# EAGLE design PROK drum_B (EAGLE 7.4.0)
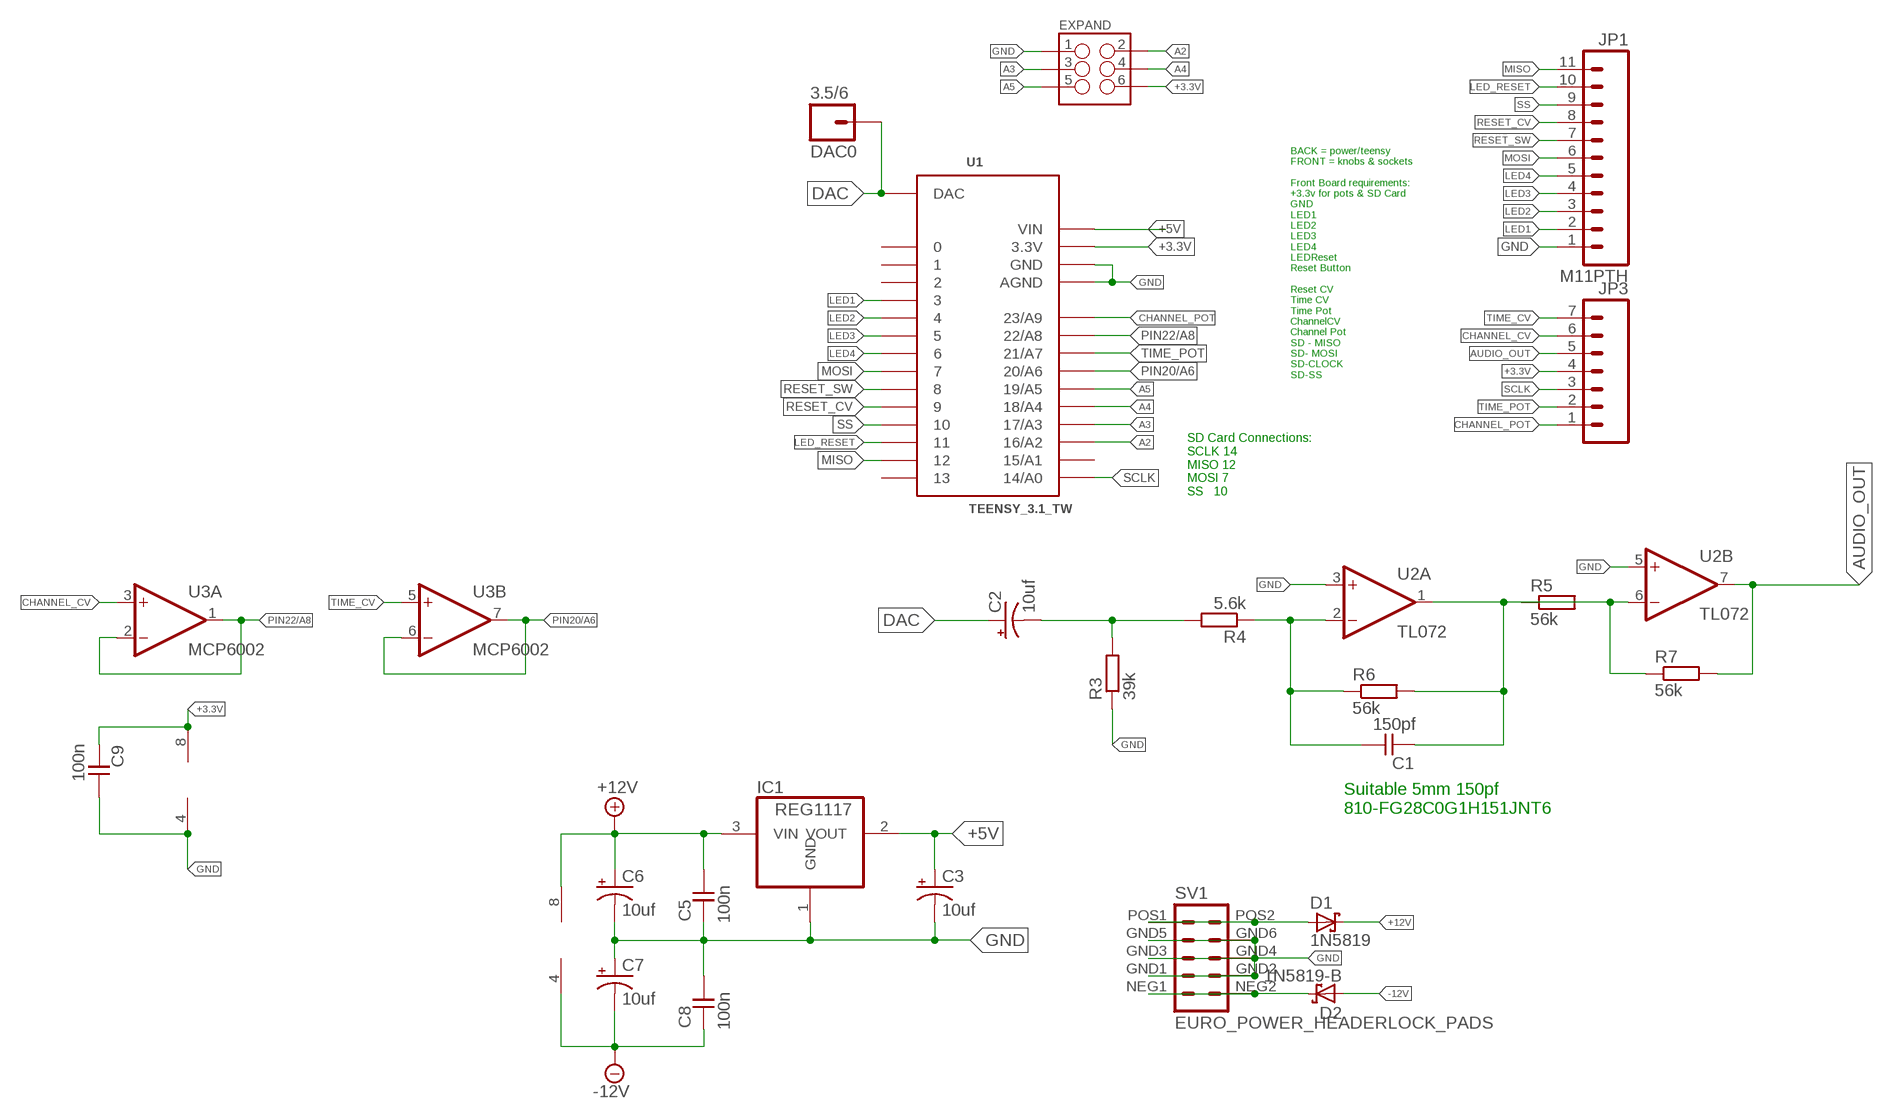
[diagram p0: schematic, sheet 1]

## Parts
3.5/6  DAC0  M01PTH  [1X01]
C1  150pf  C-EU050-024X044  [C050-024X044]
C2  10uf  CAP_POLPTH2  [CPOL-RADIAL-10UF-25V]
C3  10uf  CAP_POLPTH2  [CPOL-RADIAL-10UF-25V]
C5  100n  C-EU050-024X044  [C050-024X044]
C6  10uf  CAP_POLPTH2  [CPOL-RADIAL-10UF-25V]
C7  10uf  CAP_POLPTH2  [CPOL-RADIAL-10UF-25V]
C8  100n  C-EU050-024X044  [C050-024X044]
C9  100n  C-EU050-024X044  [C050-024X044]
D1  1N5819  1N5819-B  [DO41-7.6]
D2  1N5819-B  [DO41-7.6]
EXPAND  M03X22X3_SILK_SM  [2X3]
IC1  REG1117  [SOT223]
JP1  M11PTH  [1X11]
JP3  M07  [1X07]
R3  39k  RESISTOR7MM  [7MM_RESISTOR]
R4  5.6k  RESISTOR7MM  [7MM_RESISTOR]
R5  56k  RESISTOR7MM  [7MM_RESISTOR]
R6  56k  RESISTOR7MM  [7MM_RESISTOR]
R7  56k  RESISTOR7MM  [7MM_RESISTOR]
SV1  EURO_POWER_HEADERLOCK_PADS  [EURO_PWR_HEADER_LOCK]
U1  TEENSY_3.1_TW  [TEENSY_3.1_TW]
U2  TL072  [DIL08-SML]
U3  MCP6002  MCP6002DIL_SMALL  [DIL08-SML]

## Nets
+3.3V: C9.2 EXPAND.6 JP3.4 U1.3.3V U3.8(P:V+)
+5V: C3.1(+) IC1.2(VOUT) U1.VIN
+12V [power]: C5.1 C6.1(+) D1.C IC1.3(VIN) U2.8(P:V+)
-12V [power]: C7.2(-) C8.2 D2.A U2.4(P:V-)
A2: EXPAND.2 U1.16/A2
A3: EXPAND.3 U1.17/A3
A4: EXPAND.4 U1.18/A4
A5: EXPAND.5 U1.19/A5
AUDIO_OUT: JP3.5 R7.2 U2.7(B:OUT)
CHANNEL_CV: JP3.6 U3.3(A:+IN)
CHANNEL_POT: JP3.1 U1.23/A9
DAC: 3.5/6.1 C2.1(+) U1.DAC
GND [ground]: C3.2(-) C5.2 C6.2(-) C7.1(+) C8.1 C9.1 EXPAND.1 IC1.1(GND) JP1.1 R3.1 SV1.GND1 SV1.GND2 SV1.GND3 SV1.GND4 SV1.GND5 SV1.GND6 U1.AGND U1.GND U2.3(A:+IN) U2.5(B:+IN) U3.4(P:V-)
LED1: JP1.2 U1.3
LED2: JP1.3 U1.4
LED3: JP1.4 U1.5
LED4: JP1.5 U1.6
LED_RESET: JP1.10 U1.11
MISO: JP1.11 U1.12
MOSI: JP1.6 U1.7
N$1: C2.2(-) R3.2 R4.2
N$2: C1.1 R4.1 R6.1 U2.2(A:-IN)
N$3: R5.1 R7.1 U2.6(B:-IN)
N$4: C1.2 R5.2 R6.2 U2.1(A:OUT)
N$5: D1.A SV1.POS1 SV1.POS2
N$9: D2.C SV1.NEG1 SV1.NEG2
PIN20/A6: U1.20/A6 U3.6(B:-IN) U3.7(B:OUT)
PIN22/A8: U1.22/A8 U3.1(A:OUT) U3.2(A:-IN)
RESET_CV: JP1.8 U1.9
RESET_SW: JP1.7 U1.8
SCLK: JP3.3 U1.14/A0
SS: JP1.9 U1.10
TIME_CV: JP3.7 U3.5(B:+IN)
TIME_POT: JP3.2 U1.21/A7
Unconnected: U1.0 U1.1 U1.2 U1.13 U1.15/A1

## Notes on the sheet
- BACK = power/teensy
  FRONT = knobs & sockets
  
  Front Board requirements:
  +3.3v for pots & SD Card 
  GND 
  LED1
  LED2
  LED3
  LED4
  LEDReset
  Reset Button
  
  Reset CV 
  Time CV
  Time Pot
  ChannelCV
  Channel Pot
  SD - MISO
  SD- MOSI
  SD-CLOCK
  SD-SS
- SD Card Connections: 
   SCLK 14
   MISO 12
   MOSI 7 
   SS   10
- Suitable 5mm 150pf 
  810-FG28C0G1H151JNT6

## Library data of the parts
3.5/6 = SparkFun-Connectors:M01: Header 1 Standard 1-pin 0.1" header. Use with straight break away headers (SKU : PRT-00116), right angle break away headers (PRT-00553), swiss pins (PRT-00743), machine pins (PRT-00117), and female headers (PRT-00115).
C1 C5 C8 C9 = TomW:C-EU: CAPACITOR, European symbol
C2 C3 C6 C7 = SparkFun-Passives:CAP_POL: Capacitor Polarized These are standard SMD and PTH capacitors. Normally 10uF, 47uF, and 100uF in electrolytic and tantalum varieties. Always verify the external diameter of the through hole cap, it varies with capacity, voltage, and manufacturer. The EIA devices should be standard.
D1 D2 = diode:1N581*: 1.0A SCHOTTKY BARRIER RECTIFIER Source: http://www.diodes.com/datasheets/ds23001.pdf
EXPAND = SparkFun-Connectors:M03X2: 2x3 .1" header. Shrouded, with keying- CONN-10681 SMT- CONN-11415 Pogo pins- HW-11044
IC1 = burr-brown:REG1117: 800mA and 1A Low Dropout (LDO) Positive Regulator 1.8V, 2.5V, 2.85V, 3.3V, 5V, and Adj; MPN: REG1117; OC_FARNELL: 1097566; OC_NEWARK: 14P6981
JP1 = SparkFun-Connectors:M11: Header 11 Standard 11-pin 0.1" header. Use with straight break away headers (SKU : PRT-00116), right angle break away headers (PRT-00553), swiss pins (PRT-00743), machine pins (PRT-00117), and female headers (PRT-00115).
JP3 = SparkFun-Connectors:M07: Header 7 Standard 7-pin 0.1" header. Use with straight break away headers (SKU : PRT-00116), right angle break away headers (PRT-00553), swiss pins (PRT-00743), machine pins (PRT-00117), and female headers (PRT-00115). NOTES ON THE VARIANTS LOCK and LOCK_LONGPADS... This footprint was designed to help hold the alignment of a through-hole component (i.e. 7-pin header) while soldering it into place. You may notice that each hole has been shifted either up or down by 0.005 of an inch from it's more standard position (which is usually a perfectly straight line). This slight alteration caused the pins (the squares in the middle) to touch the edges of the holes. Because they are alternating, it causes a "brace" to hold the header in place. 0.005 has proven to be the perfect amount of "off-center" position when using our standard breakaway headers. Although looks a little odd when you look at the bare footprint, once you have a header in there, the alteration is very hard to notice. Also, if you push a header all the way into place, it is covered up entirely on the bottom side. This idea of altering the position of holes to aid alignment will be further integrated into the Sparkfun Library for other footprints. It can help hold any component with 3 or more connection pins.
R3-R7 = MusicThingModular:RESISTOR: Standard resistor, various versions
SV1 = MusicThingModular:EURO_POWER_HEADER: Power Header 10 pin power header for Eurorack Power Supplies Variants with fatter pads for easier soldering, and the LOCK variant which has 5mil offset pins to hold the component in place before soldering
U1 = TomW:TEENSY_3.1_TW: Basic Teensy 3.0 with none of the 'inner' pins enabled. See '+4', 'AllAnalogPins", and 'AllPins' packages for additional pin holes, as needed.
U2 = MusicThingModular:TL072: Generic Dual Op Amp
U3 = MusicThingModular:MCP6002: Generic Dual Op Amp

## Net classes
0 default: width 0.203 mm
1 power: width 0.406 mm
2 ground: width 0.305 mm

## Board
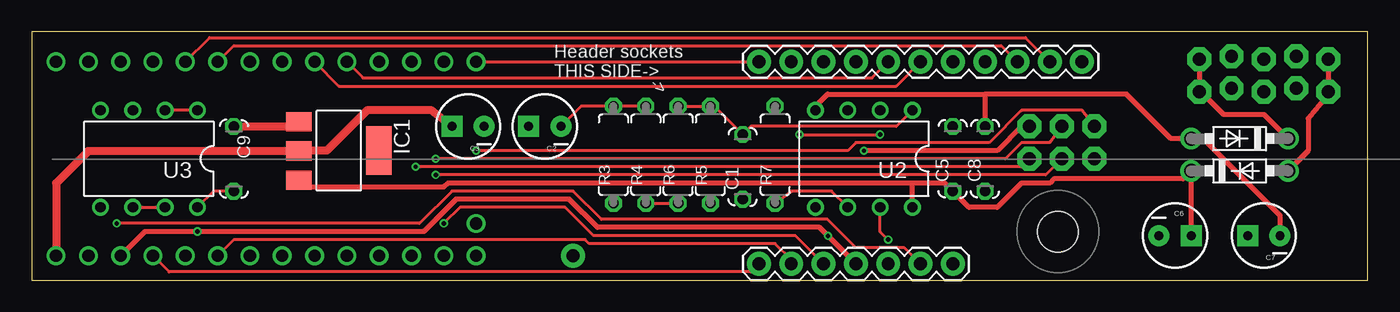
[diagram p1: board, top side]
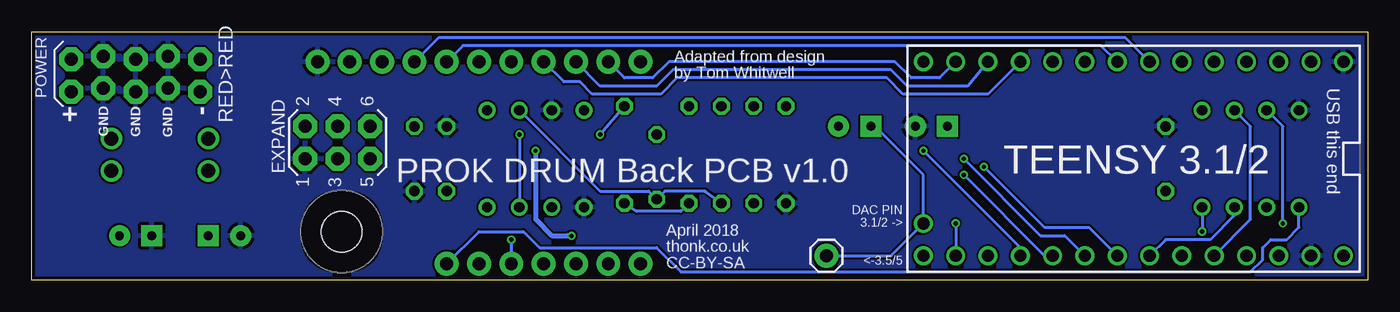
[diagram p2: board, bottom side, seen from below]

Size 105 x 19.5 mm. Coordinates in mm from the lower left corner, seen from the top.
Outline: 0,19.5 0,0 105,0 105,19.5 0,19.5
Copper layers (1*2*15*16): Top 0.035mm / dielectric 0.2mm / Route2 0.0175mm / dielectric 1.1mm / Route15 0.0175mm / dielectric 0.2mm / Bottom 0.035mm
Design rules "SeeedStudio_DRU_no_angle_20130527 *": minimum track width 6mil, minimum drill 12mil, track to track 6mil, track to pad 6mil, pad to pad 6mil, via to via 6mil, smd to smd 0mil, copper to edge 10mil, drill to drill 10mil, minimum pad ring 10mil, minimum via ring 6mil, stop-mask expansion 2mil, vias tented up to drill 25mil, thermal gap 10mil

### Footprints (pad centres in the part's own frame; a part is rotated, then mirrored left to right if it is on the bottom)
1X01 = drill 1.016 pad 1.88: 1 0,0
C050-024X044 = drill 0.813 octagon: 1 -2.54,0; 2 2.54,0
CPOL-RADIAL-10UF-25V = drill 0.7 pad 1.651 square: 1 1.27,0 | drill 0.7 pad 1.651: 2 -1.27,0
DO41-7.6 = drill 1.1 pad 1.7: A 3.81,0; C -3.81,0
2X3 = drill 1.016 pad 1.88 octagon: 1 0,0; 2 0,2.54; 3 2.54,0; 4 2.54,2.54; 5 5.08,0; 6 5.08,2.54
SOT223 = smd 1.499 x 2.007: 1 -2.261,-3.15; 2 0.025,-3.15; 3 2.311,-3.15 | smd 3.81 x 2.007: 4 0,3.15
1X11 = drill 1.016 pad 1.88: 1 0,0; 2 2.54,0; 3 5.08,0; 4 7.62,0; 5 10.16,0; 6 12.7,0; 7 15.24,0; 8 17.78,0; 9 20.32,0; 10 22.86,0; 11 25.4,0
1X07 = drill 1.016 pad 1.88: 1 0,0; 2 2.54,0; 3 5.08,0; 4 7.62,0; 5 10.16,0; 6 12.7,0; 7 15.24,0
7MM_RESISTOR = drill 0.813 octagon: 1 -3.81,0; 2 3.81,0
EURO_PWR_HEADER_LOCK = drill 1.016 pad 1.88 octagon: GND1 -2.54,1.143; GND2 -2.54,-1.397; GND3 0,1.397; GND4 0,-1.143; GND5 2.54,1.143; GND6 2.54,-1.397; NEG1 -5.08,1.397; NEG2 -5.08,-1.143; POS1 5.08,1.397; POS2 5.08,-1.143
TEENSY_3.1_TW = drill 0.965: 0 -7.62,13.97; 1 -7.62,11.43; 2 -7.62,8.89; 3 -7.62,6.35; 3.3V 7.62,11.43; 4 -7.62,3.81; 5 -7.62,1.27; 6 -7.62,-1.27; 7 -7.62,-3.81; 8 -7.62,-6.35; 9 -7.62,-8.89; 10 -7.62,-11.43; 11 -7.62,-13.97; 12 -7.62,-16.51; 13 7.62,-16.51; 14/A0 7.62,-13.97; 15/A1 7.62,-11.43; 16/A2 7.62,-8.89; 17/A3 7.62,-6.35; 18/A4 7.62,-3.81; 19/A5 7.62,-1.27; 20/A6 7.62,1.27; 21/A7 7.62,3.81; 22/A8 7.62,6.35; 23/A9 7.62,8.89; AGND 7.62,13.97; DAC 5.08,-16.51; GND -7.62,16.51; VIN 7.62,16.51
DIL08-SML = drill 0.813 pad 1.27: 1 -3.81,-3.81; 2 -1.27,-3.81; 3 1.27,-3.81; 4 3.81,-3.81; 5 3.81,3.81; 6 1.27,3.81; 7 -1.27,3.81; 8 -3.81,3.81
MOUNTING_HOLE = hole 3.2: 0,0

### Placement (x,y rotation side)
3.5/6  42.55,1.91 0 bottom
C1  55.88,8.89 90 top
C2  40.32,12.06 180 top
C3  34.29,12.06 180 top
C5  72.39,9.53 90 top
C6  89.85,3.49 0 top
C7  96.84,3.49 180 top
C8  74.93,9.53 90 top
C9  15.88,9.53 270 top
D1  94.93,8.57 0 top
D2  94.93,11.11 180 top
EXPAND  83.5,9.53 0 bottom
IC1  24.13,10.16 270 top
JP1  82.55,17.14 180 top
JP3  57.15,1.27 0 top
R3  45.72,9.84 90 top
R4  48.26,9.84 90 top
R5  53.34,9.84 90 top
R6  50.8,9.84 90 top
R7  58.42,9.84 90 top
SV1  96.84,16.19 180 bottom
U1  18.41,9.53 270 bottom
U2  65.41,9.53 180 top
U3  9.21,9.53 180 top
U$1  [MOUNTING_HOLE]  80.64,3.81 0 top

### Tracks (layer width: path | path; a pad name or v marks a point on that pad's centre or on a via)
+3.3V  (via drill 0.33)
  Top 0.254: C9.2 14.29,6.99 U3.8
  Top 0.406: JP3.4 v62.58,3.46 61.91,4.13 44.45,4.13 42.23,6.35 33.34,6.35 30.8,3.81 v13.02,3.81 8.89,3.81 U1.3.3V | EXPAND.6 77.79,12.06 75.88,10.16 v65.41,10.16
  Bottom 0.254: U3.8 v13.02,3.81
  Bottom 0.406: v65.41,10.16 65.41,4.76 64.14,3.49 62.87,3.49 v62.58,3.46
+5V
  Top 0.254: 21.01,10.16 IC1.2
  Top 0.61: C3.1 31.43,13.34 26.35,13.34 23.18,10.16 21.01,10.16 | IC1.2 4.42,10.13 1.91,7.62 U1.VIN
+12V
  Top 0.406: C6.1 D1.C 90.49,7.94 80.33,7.94 80.01,7.62 77.79,7.62 75.88,5.71 73.66,5.71 C5.1 71.75,7.62 69.22,7.62 | 69.22,7.62 32.7,7.62 32.38,7.3 21.59,7.3 21.21,7.62 IC1.3 | U2.8 69.22,7.62
-12V
  Top 0.406: C7.2 98.11,5.08 92.08,11.11 D2.A 89.53,11.11 86.04,14.61 74.93,14.61 | 74.93,14.61 C8.2 | U2.4 61.59,13.65 62.55,14.61 74.93,14.61
A2  (via drill 0.33)
  Top 0.254: EXPAND.2 82.55,13.34 77.79,13.34 75.25,10.79 64.77,10.79 64.14,10.16 v34.92,10.16
  Bottom 0.254: v34.92,10.16 27.3,2.54 U1.16/A2
A3  (via drill 0.33)
  Top 0.254: EXPAND.3 79.69,8.26 v31.75,8.26
  Bottom 0.254: v31.75,8.26 25.4,1.91 U1.17/A3
A4  (via drill 0.33)
  Top 0.254: EXPAND.4 80.01,10.79 77.79,10.79 76.52,9.53 v31.75,9.53
  Bottom 0.254: v31.75,9.53 25.72,3.49 23.81,3.49 U1.18/A4
A5  (via drill 0.33)
  Top 0.254: EXPAND.5 77.79,8.89 v30.16,8.89
  Bottom 0.254: v30.16,8.89 25.4,4.13 21.91,4.13 U1.19/A5
AUDIO_OUT  (via drill 0.33)
  Top 0.254: v67.31,3.17 66.67,3.81 U2.7 | v60.33,11.43 v66.67,11.43
  Bottom 0.254: JP3.5 v67.31,3.17 | R7.2 v60.33,11.43 | v66.67,11.43 U2.7
CHANNEL_CV  (via drill 0.33)
  Top 0.254: JP3.6 68.58,2.54 64.77,2.54 62.55,4.76 44.77,4.76 42.55,6.99 33.02,6.99 30.48,4.45 v6.67,4.45
  Bottom 0.254: v6.67,4.45 6.67,12.06 U3.3
CHANNEL_POT
  Top 0.254: JP3.1 56.52,0.64 10.79,0.64 U1.23/A9
DAC
  Bottom 0.254: 3.5/6.1 37.47,1.91 U1.DAC 34.92,8.26 38.73,12.06 C2.1
GND
  Top 0.61: C9.1 20.62,12.06 IC1.1
  pour Bottom: -1.27,-1.27 109.22,-1.27 109.22,20.95 -1.27,20.95
LED1
  Top 0.254: U1.3 13.97,19.05 78.11,19.05 JP1.2
LED2
  Top 0.254: U1.4 15.88,18.41 76.2,18.41 JP1.3
LED3
  Bottom 0.254: U1.5 19.05,19.05 73.03,19.05 JP1.4
LED4
  Bottom 0.254: U1.6 20.95,18.41 71.12,18.41 JP1.5
LED_RESET
  Bottom 0.254: U1.11 33.66,15.88 35.88,15.88 37.15,17.14 54.93,17.14 56.2,15.88 58.42,15.88 JP1.10
MISO
  Top 0.254: U1.12 JP1.11
MOSI
  Top 0.254: U1.7 24.13,15.24 67.94,15.24 JP1.6
N$1
  Top 0.254: R4.2 R3.2 43.18,13.65 42.55,13.02 C2.2
N$2
  Top 0.254: R4.1 R6.1
  Bottom 0.254: U2.2 60.33,6.99 56.52,6.99 C1.1 55.24,6.99 52.07,6.99 R6.1
N$3
  Top 0.254: U2.6 62.87,6.99 59.69,6.99 R7.1
  Bottom 0.254: R5.1 53.98,5.4 57.47,5.4 R7.1
N$4
  Top 0.254: R6.2 R5.2 53.66,13.65 C1.2 56.52,12.06 67.94,12.06 U2.1
N$5
  Top 0.406: SV1.POS2 SV1.POS1 101.92,14.61 100.33,12.7 100.33,10.16 D1.A
N$9
  Top 0.406: SV1.NEG2 SV1.NEG1 91.89,14.8 93.66,13.02 96.84,13.02 D2.C
PIN20/A6
  Top 0.254: U3.6 U3.7
  Bottom 0.254: U3.7 10.48,5.08 12.38,3.17 15.88,3.17 U1.20/A6
PIN22/A8
  Top 0.254: U3.1 U3.2
  Bottom 0.254: U1.22/A8 9.21,4.76 9.21,12.06 U3.2
RESET_CV
  Bottom 0.254: U1.9 29.84,14.61 36.51,14.61 37.78,15.88 54.29,15.88 55.56,14.61 60.96,14.61 61.91,15.56 63.18,15.56 JP1.8
RESET_SW
  Top 0.254: U1.8 26.04,15.88 66.04,15.88 JP1.7
SCLK  (via drill 0.33)
  Top 0.254: JP3.3 60.01,3.49 44.13,3.49 41.91,5.71 33.66,5.71 v32.38,4.45
  Bottom 0.254: v32.38,4.45 U1.14/A0
SS
  Bottom 0.254: U1.10 31.43,15.24 36.2,15.24 37.47,16.51 54.61,16.51 55.88,15.24 60.33,15.24 JP1.9
TIME_CV
  Bottom 0.254: JP3.7 69.85,3.81 66.36,3.81 65.09,2.54 55.88,2.54 53.98,0.64 9.21,0.64 8.26,1.59 8.26,2.54 7.62,3.17 6.35,3.17 5.4,4.13 U3.5
TIME_POT
  Top 0.254: JP3.2 59.69,1.59 58.42,2.86 43.81,2.86 43.5,3.17 15.88,3.17 U1.21/A7

### Text on the board
tPlace: -> | Header sockets / THIS SIDE->
bPlace: Adapted from design / by Tom Whitwell | USB this end | PROK DRUM Back PCB v1.0 | TEENSY 3.1/2 | DAC PIN / 3.1/2 -> / / / <-3.5/5 | April 2018 / thonk.co.uk / CC-BY-SA